# Altium schematic sheet PART-00-可预置时间倒计时电路原理R00-49.SchDoc
size A4
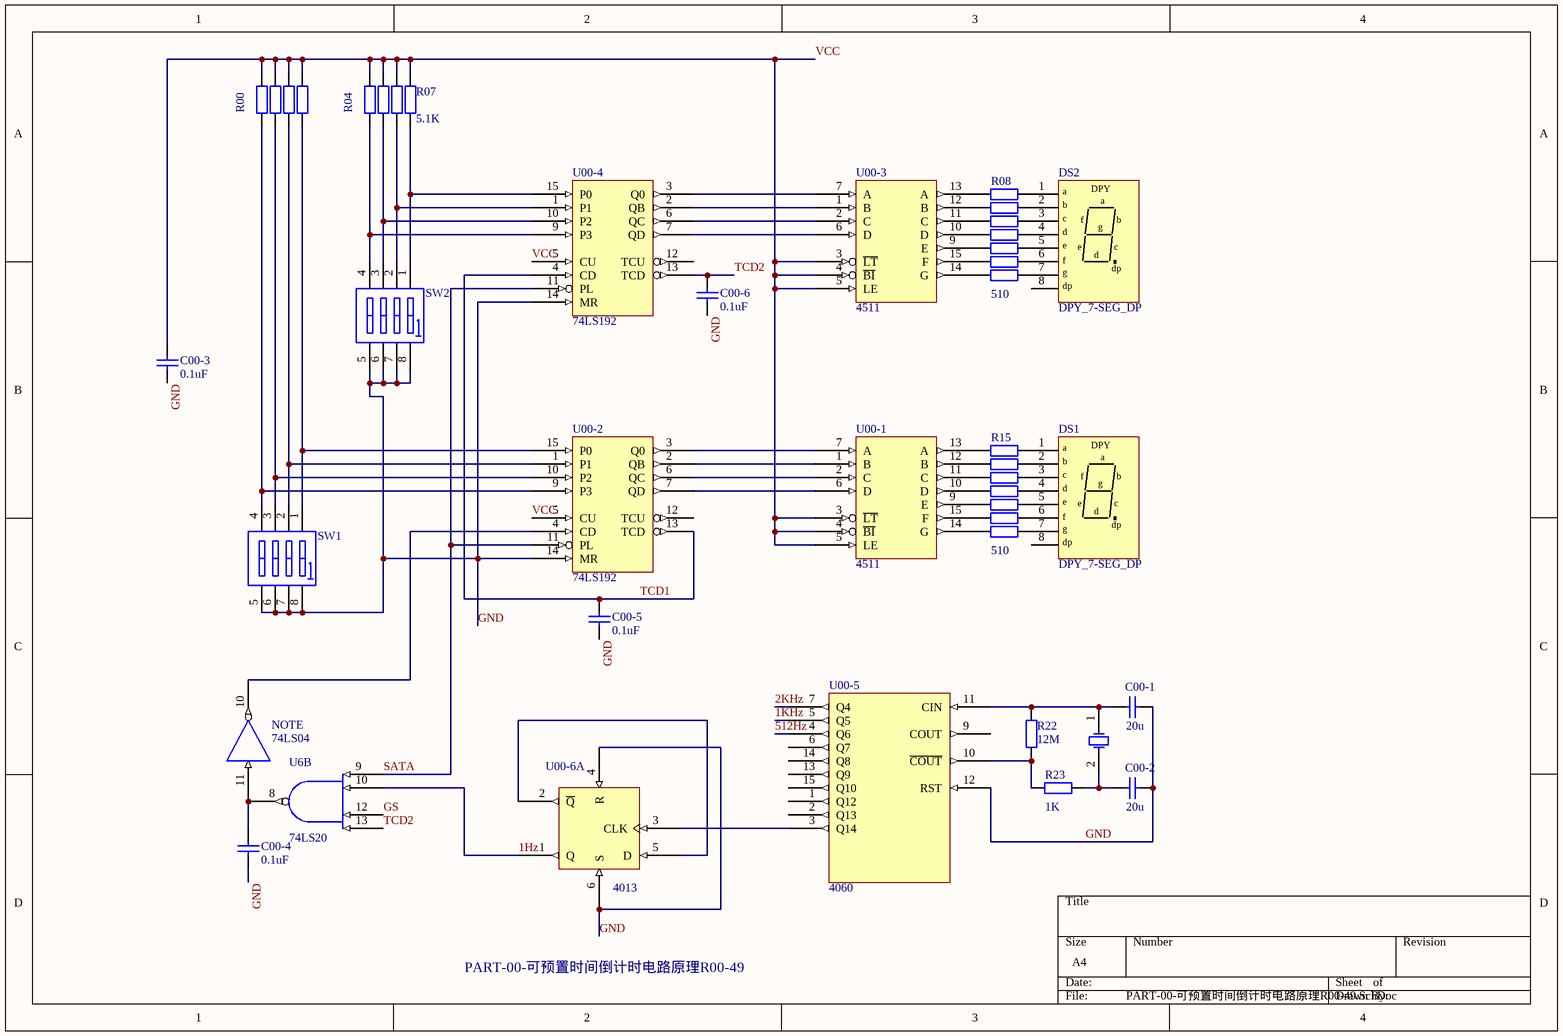
[diagram p0: PART-00-可预置时间倒计时电路原理R00-49.SchDoc]

## Parts
C00-1  value 20u  [RAD-0.3]  (hidden comment: Cap)
C00-2  value 20u  [RAD-0.3]  (hidden comment: Cap)
C00-3  value 0.1uF  [RAD-0.3]  (hidden comment: Cap)
C00-4  value 0.1uF  [RAD-0.3]  (hidden comment: Cap)
C00-5  value 0.1uF  [RAD-0.3]  (hidden comment: Cap)
C00-6  value 0.1uF  [RAD-0.3]  (hidden comment: Cap)
DS1  DPY_7-SEG_DP  [8-.5]
DS2  DPY_7-SEG_DP  [8-.5]
NOT  74LS04  [DIP-14]  (part E of 6)
R00  Res2  [AXIAL-0.4]  (value not drawn)
R01  Res2  [AXIAL-0.4]  (value not drawn)
R02  Res2  [AXIAL-0.4]  (value not drawn)
R03  Res2  [AXIAL-0.4]  (value not drawn)
R04  Res2  [AXIAL-0.4]  (value not drawn)
R05  Res2  [AXIAL-0.4]  (value not drawn)
R06  Res2  [AXIAL-0.4]  (value not drawn)
R07  value 5.1K  [AXIAL-0.4]  (hidden comment: Res2)
R08  value 510  [AXIAL-0.4]  (hidden comment: Res2)
R09  Res2  [AXIAL-0.4]  (value not drawn)
R10  Res2  [AXIAL-0.4]  (value not drawn)
R11  Res2  [AXIAL-0.4]  (value not drawn)
R12  Res2  [AXIAL-0.4]  (value not drawn)
R13  Res2  [AXIAL-0.4]  (value not drawn)
R14  Res2  [AXIAL-0.4]  (value not drawn)
R15  value 510  [AXIAL-0.4]  (hidden comment: Res2)
R16  Res2  [AXIAL-0.4]  (value not drawn)
R17  Res2  [AXIAL-0.4]  (value not drawn)
R18  Res2  [AXIAL-0.4]  (value not drawn)
R19  Res2  [AXIAL-0.4]  (value not drawn)
R20  Res2  [AXIAL-0.4]  (value not drawn)
R21  Res2  [AXIAL-0.4]  (value not drawn)
R22  value 12M  [AXIAL-0.4]  (hidden comment: Res2)
R23  value 1K  [AXIAL-0.4]  (hidden comment: Res2)
SW1  SW DIP-4  [SO8]  (value not drawn)
SW2  SW DIP-4  [SO8]  (value not drawn)
U00-1  4511  [DIP-16]
U00-2  74LS192  [DIP-16]
U00-3  4511  [DIP-16]
U00-4  74LS192  [DIP-16]
U00-5  4060  [DIP-16]
U00-6  4013  [DIP-14]  (part A of 2)
U6  74LS20  [DIP-14]  (part B of 2)
Y?  XTAL  [R38]  (value not drawn)

## Nets
GND: C00-1.2 C00-2.2 C00-3.1 C00-4.1 C00-5.1 C00-6.1 NOT.7(GND) SW1.5(B4) SW1.6(B3) SW1.7(B2) SW1.8(B1) SW2.5(B4) SW2.6(B3) SW2.7(B2) SW2.8(B1) U00-1.8(GND) U00-2.8(GND) U00-2.14(MR) U00-3.8(GND) U00-4.8(GND) U00-4.14(MR) U00-5.8(GND) U00-5.12(RST) U00-6.4(R) U00-6.6(S) U00-6.7(GND) U6.7(GND)
VCC: C00-3.2 NOT.14(VCC) R00.1 R01.1 R02.1 R03.1 R04.1 R05.1 R06.1 R07.1 U00-1.3(~{LT}) U00-1.4(~{BI}) U00-1.5(LE) U00-1.16(VCC) U00-2.5(CU) U00-2.16(VCC) U00-3.3(~{LT}) U00-3.4(~{BI}) U00-3.5(LE) U00-3.16(VCC) U00-4.5(CU) U00-4.16(VCC) U00-5.16(VCC) U00-6.14(VCC) U6.14(VCC)
1Hz: U00-6.1(Q) U6.10
1KHz: U00-5.5(Q5)
2KHz: U00-5.7(Q4)
512Hz: U00-5.4(Q6)
GS: U6.12
SATA: U00-2.11(PL) U00-4.11(PL) U6.9
TCD1: C00-5.2 U00-2.13(TCD) U00-4.4(CD)
TCD2: C00-6.2 U00-4.13(TCD) U6.13
NetC00-1_1: C00-1.1 R22.2 U00-5.11(CIN) Y?.1(OSC1)
NetC00-2_1: C00-2.1 R23.2 Y?.2(OSC2)
NetC00-4_2: C00-4.2 NOT.11 U6.8
NetDS1_1: DS1.1(a) R15.2
NetDS1_2: DS1.2(b) R16.2
NetDS1_3: DS1.3(c) R17.2
NetDS1_4: DS1.4(d) R18.2
NetDS1_5: DS1.5(e) R19.2
NetDS1_6: DS1.6(f) R20.2
NetDS1_7: DS1.7(g) R21.2
NetDS2_1: DS2.1(a) R08.2
NetDS2_2: DS2.2(b) R09.2
NetDS2_3: DS2.3(c) R10.2
NetDS2_4: DS2.4(d) R11.2
NetDS2_5: DS2.5(e) R12.2
NetDS2_6: DS2.6(f) R13.2
NetDS2_7: DS2.7(g) R14.2
NetNOT_10: NOT.10 U00-2.4(CD)
NetR00_2: R00.2 SW1.4(A4) U00-2.9(P3)
NetR01_2: R01.2 SW1.3(A3) U00-2.10(P2)
NetR02_2: R02.2 SW1.2(A2) U00-2.1(P1)
NetR03_2: R03.2 SW1.1(A1) U00-2.15(P0)
NetR04_2: R04.2 SW2.4(A4) U00-4.9(P3)
NetR05_2: R05.2 SW2.3(A3) U00-4.10(P2)
NetR06_2: R06.2 SW2.2(A2) U00-4.1(P1)
NetR07_2: R07.2 SW2.1(A1) U00-4.15(P0)
NetR08_1: R08.1 U00-3.13(A)
NetR09_1: R09.1 U00-3.12(B)
NetR10_1: R10.1 U00-3.11(C)
NetR11_1: R11.1 U00-3.10(D)
NetR12_1: R12.1 U00-3.9(E)
NetR13_1: R13.1 U00-3.15(F)
NetR14_1: R14.1 U00-3.14(G)
NetR15_1: R15.1 U00-1.13(A)
NetR16_1: R16.1 U00-1.12(B)
NetR17_1: R17.1 U00-1.11(C)
NetR18_1: R18.1 U00-1.10(D)
NetR19_1: R19.1 U00-1.9(E)
NetR20_1: R20.1 U00-1.15(F)
NetR21_1: R21.1 U00-1.14(G)
NetR22_1: R22.1 R23.1 U00-5.10(~{COUT})
NetU00-1_1: U00-1.1(B) U00-2.2(QB)
NetU00-1_2: U00-1.2(C) U00-2.6(QC)
NetU00-1_6: U00-1.6(D) U00-2.7(QD)
NetU00-1_7: U00-1.7(A) U00-2.3(Q0)
NetU00-3_1: U00-3.1(B) U00-4.2(QB)
NetU00-3_2: U00-3.2(C) U00-4.6(QC)
NetU00-3_6: U00-3.6(D) U00-4.7(QD)
NetU00-3_7: U00-3.7(A) U00-4.3(Q0)
NetU00-5_3: U00-5.3(Q14) U00-6.3(CLK)
NetU00-6_2: U00-6.2(~{Q}) U00-6.5(D)

Not connected (* = marked no-connect by the designer): DS1 8(dp); DS2 8(dp); U00-2 12(TCU); U00-4 12(TCU); U00-5 1(Q12) 2(Q13) 6(Q7) 9(COUT) 13(Q9) 14(Q8) 15(Q10)

## Notes on the sheet
- PART-00-可预置时间倒计时电路原理R00-49
- (in symbol DPY_7-SEG_DP) DPY

## Library data of the parts
C00-1-C00-6 = Cap: Capacitor; Published: 8-Jun-2000; LatestRevisionDate: 17-Jul-2002; LatestRevisionNote: Re-released for DXP Platform.; PackageReference: RAD-0.3; Publisher: Altium Limited
DS1 DS2 = DPY_7-SEG_DP: Seven-Segment Display, Right Hand Decimal
R00 R01 R02 R03 R04 R05 R06 = Res2: Resistor; Value: 5.1K; Published: 8-Jun-2000; LatestRevisionDate: 17-Jul-2002; LatestRevisionNote: Re-released for DXP Platform.; PackageReference: AXIAL-0.4; Publisher: Altium Limited
R07 R08 R15 R22 R23 = Res2: Resistor; Published: 8-Jun-2000; LatestRevisionDate: 17-Jul-2002; LatestRevisionNote: Re-released for DXP Platform.; PackageReference: AXIAL-0.4; Publisher: Altium Limited
R09-R14 R16-R21 = Res2: Resistor; Value: 510; Published: 8-Jun-2000; LatestRevisionDate: 17-Jul-2002; LatestRevisionNote: Re-released for DXP Platform.; PackageReference: AXIAL-0.4; Publisher: Altium Limited
SW1 SW2 = SW DIP-4: DIP Switch, 4 Position, SPST; Published: 24-Mar-1999; LatestRevisionDate: 17-Jul-2002; LatestRevisionNote: Re-released for DXP Platform.; PackageReference: SO8; Publisher: Altium Limited; Code_JEDEC: MS-012-AA; Code_IPC: SO8
U00-2 U00-4 = 74HC192
Y? = XTAL: Crystal Oscillator; Published: 8-Jun-2000; LatestRevisionDate: 17-Jul-2002; LatestRevisionNote: Re-released for DXP Platform.; PackageReference: R38; Publisher: Altium Limited